# EAGLE design mcp801_test (EAGLE 6.5.0)

## Sheet 1 of 2
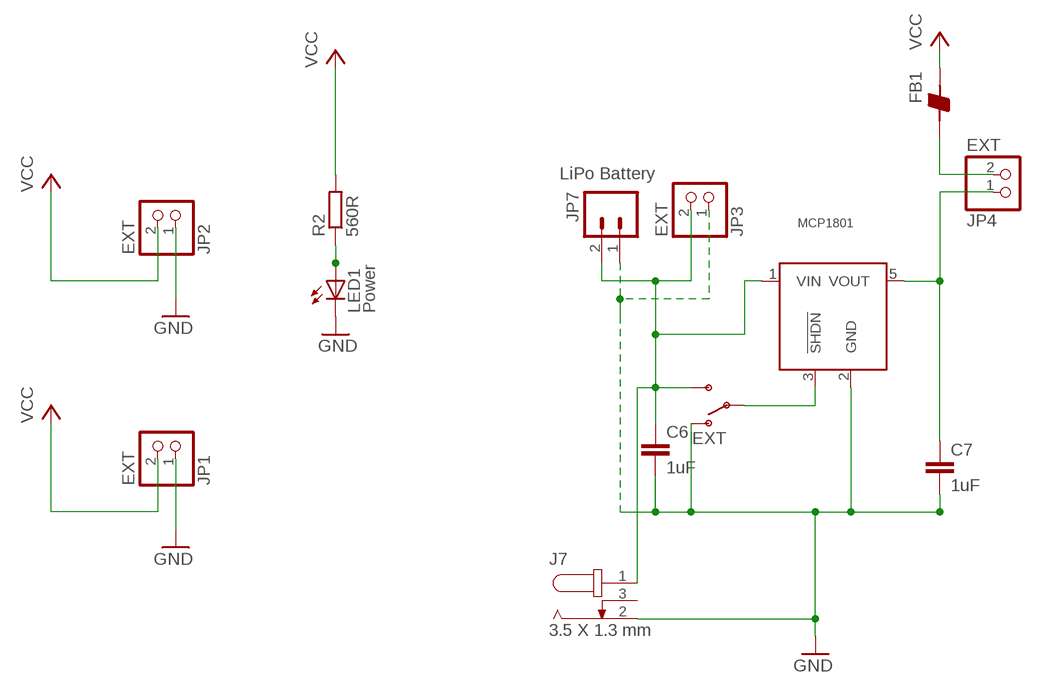
[diagram p0: schematic, sheet 1]

### Parts
C6  1uF  C-EUC0805  [C0805]
C7  1uF  C-EUC0805  [C0805]
FB1  BEAD-0805  [0805]
J7  3.5 X 1.3 mm  DC_JACK_3.5X1.3MM  [3.5X1.3MM_DC_JACK]
JP1  EXT  PINHD-1X2  [1X02]
JP2  EXT  PINHD-1X2  [1X02]
JP3  EXT  PINHD-1X2  [1X02]
JP4  EXT  PINHD-1X2  [1X02]
JP7  LiPo Battery  M02JST-PTH-2  [JST-2-PTH]
LED1  Power  LEDCHIPLED_1206  [CHIPLED_1206]
MCP1801  MCP180XSOT-23-5  [SOT-23-5]
ON  EXT  SWITCH-SPSTPTH  [SWITCH-SPDT]
R2  560R  R-EU_R0805  [R0805]

### Nets
GND [GND]: C6.2 C7.2 J7.2 JP1.1 JP2.1 JP3.1 JP7.1 LED1.C MCP1801.2(GND) ON.1(O)
N$1: MCP1801.3(!SHDN) ON.2(P)
N$2 [VCCEXT]: FB1.1 JP4.2
N$4: LED1.A R2.1
VCC [VCC]: FB1.2 JP1.2 JP2.2 R2.2
VCCEXT [VCCEXT]: C6.1 J7.1 JP3.2 JP7.2 MCP1801.1(VIN) ON.3(S)
VCCREGOUT [VCCEXT]: C7.1 JP4.1 MCP1801.5(VOUT)
Unconnected: J7.3

## Sheet 2 of 2

## Library data of the parts
C6 C7 = resistor:C-EU: CAPACITOR, European symbol
FB1 = CH_passive:BEAD
J7 = MY_CONN:DC_JACK_3.5X1.3MM
JP1-JP4 = pinhead:PINHD-1X2: PIN HEADER
JP7 = SparkFun:M02: Header 2 Standard 2-pin 0.1" header. Use with straight break away headers (SKU : PRT-00116), right angle break away headers (PRT-00553), swiss pins (PRT-00743), machine pins (PRT-00117), and female headers (PRT-00115). Molex polarized connector foot print use with SKU : PRT-08233 with associated crimp pins and housings.
LED1 = adafruit:LED: LED OSRAM: - CHIPLED LG R971, LG N971, LY N971, LG Q971, LY Q971, LO R971, LY R971 LH N974, LH R974 LS Q976, LO Q976, LY Q976 LO Q996 - Hyper CHIPLED LW Q18S LB Q993, LB Q99A, LB R99A - SideLED LS A670, LO A670, LY A670, LG A670, LP A670 LB A673, LV A673, LT A673, LW A673 LH A674 LY A675 LS A676, LA A676, LO A676, LY A676, LW A676 LS A679, LY A679, LG A679 - Hyper Micro SIDELED® LS Y876, LA Y876, LO Y876, LY Y876 LT Y87S - SmartLED LW L88C, LW L88S LB L89C, LB L89S, LG L890 LS L89K, LO L89K, LY L89K LS L896, LA L896, LO L896, LY L896 - TOPLED LS T670, LO T670, LY T670, LG T670, LP T670 LSG T670, LSP T670, LSY T670, LOP T670, LYG T670 LG T671, LOG T671, LSG T671 LB T673, LV T673, LT T673, LW T673 LH T674 LS T676, LA T676, LO T676, LY T676, LB T676, LH T676, LSB T676, LW T676 LB T67C, LV T67C, LT T67C, LS T67K, LO T67K, LY T67K, LW E67C LS E67B, LA E67B, LO E67B, LY E67B, LB E67C, LV E67C, LT E67C LW T67C LS T679, LY T679, LG T679 LS T770, LO T770, LY T770, LG T770, LP T770 LB T773, LV T773, LT T773, LW T773 LH T774 LS E675, LA E675, LY E675, LS T675 LS T776, LA T776, LO T776, LY T776, LB T776 LHGB T686 LT T68C, LB T68C - Hyper Mini TOPLED® LB M676 - Mini TOPLED Santana® LG M470 LS M47K, LO M47K, LY M47K Source: http://www.osram.convergy.de/
MCP1801 = MiscOxde:MCP180X: Cheap Microchip LDO
ON = SparkFun:SWITCH-SPST: SPST Switch Simple slide switch. Spark Fun Electronics SKU : COM-00102
R2 = resistor:R-EU_: RESISTOR, European symbol

## Net classes
0 default: width 0.279 mm, drill 0.508 mm, clearance 0.229 mm
1 GND: width 0.61 mm, drill 0.508 mm, clearance 0.229 mm
2 VCC: width 0.61 mm, drill 0.508 mm, clearance 0.229 mm
3 AD: width 0.33 mm, drill 0.508 mm, clearance 0.229 mm
4 VCCEXT: width 0.762 mm, drill 0.508 mm, clearance 0.229 mm

## Board
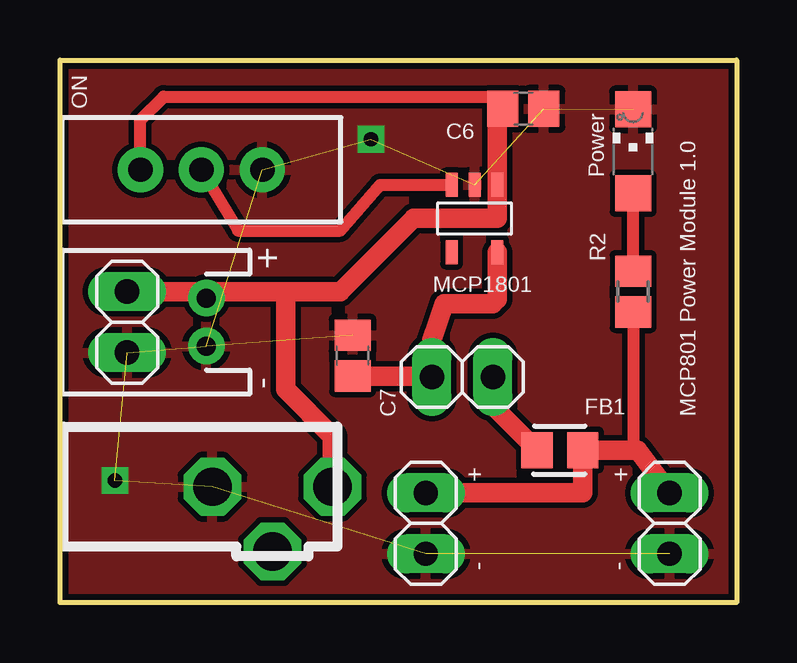
[diagram p1: board, top side]
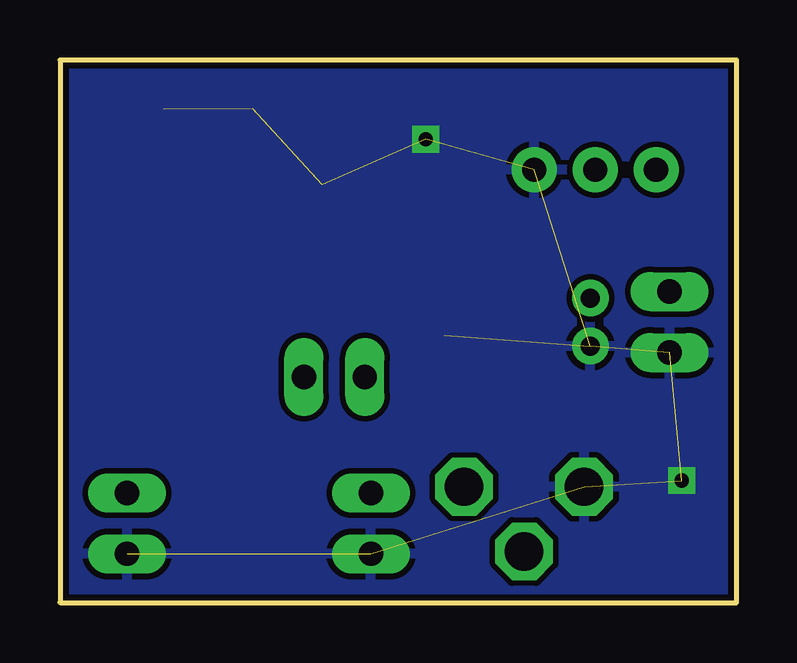
[diagram p2: board, bottom side, seen from below]

Size 28.19 x 22.61 mm. Coordinates in mm from the lower left corner, seen from the top.
Outline: 0,22.61 28.19,22.61 28.19,0 0,0 0,22.61
Copper layers (1*16): Top 0.035mm / dielectric 1.5mm / Bottom 0.035mm
Design rules "SparkFun *": minimum track width 10mil, minimum drill 20mil, track to track 8mil, track to pad 8mil, pad to pad 8mil, via to via 8mil, smd to smd 8mil, copper to edge 10mil, drill to drill 8mil, minimum pad ring 12mil, minimum via ring 10mil, stop-mask expansion 4mil, vias tented up to drill 25mil, thermal gap 10mil

### Footprints (pad centres in the part's own frame; a part is rotated, then mirrored left to right if it is on the bottom)
C0805 = smd 1.3 x 1.5: 1 -0.85,0; 2 0.85,0
0805 = smd 1.3 x 1.5: 1 -0.95,0; 2 0.95,0
3.5X1.3MM_DC_JACK = drill 1.6 octagon: 1 0,0; 2 -5,0; 3 -2.5,-2.7
1X02 = drill 1.016 long: 1 -1.27,0; 2 1.27,0
JST-2-PTH = drill 0.787 pad 1.524: 1 -1,0; 2 1,0
CHIPLED_1206 = smd 1.5 x 1.5: A 0,-1.75; C 0,1.75
SOT-23-5 = smd 0.5 x 1: 1 -0.95,-1.397; 2 0,-1.397; 3 0.95,-1.397; 4 0.95,1.397; 5 -0.95,1.397
SWITCH-SPDT = drill 1.016 pad 1.88: 1 0,2.54; 2 0,0; 3 0,-2.54
R0805 = smd 1.3 x 1.5: 1 -0.85,0; 2 0.85,0

### Placement (x,y rotation side)
C6  19.3,20.57 0 top
C7  12.19,10.29 90 top
FB1  20.83,6.35 0 top
J7  11.35,4.83 0 top
JP1  25.4,3.3 90 top
JP2  15.24,3.3 90 top
JP3  2.79,11.68 90 top
JP4  16.76,9.4 0 top
JP7  6.1,11.68 90 top
LED1  23.88,18.8 0 top
MCP1801  17.27,16 180 top
ON  5.89,18.03 270 top
R2  23.88,12.95 270 top

### Tracks (layer width: path | path; a pad name or v marks a point on that pad's centre or on a via)
GND  (via drill 0.6)  (11 unrouted)
  other vias: 2.29,5.08 12.95,19.3
  pour Top: -1.14,23.62 28.83,23.62 28.83,-0.51 -1.14,-0.51
  pour Bottom: -1.14,23.62 28.83,23.62 28.83,-0.51 -1.14,-0.51
N$1
  Top 0.508: ON.2 7.42,15.49 11.68,15.49 13.34,17.4 MCP1801.3
N$2
  Top 0.813: FB1.1 18.03,8.19 JP4.2
N$4
  Top 0.508: R2.1 LED1.A
VCC
  Top 0.508: R2.2 23.88,6.35
  Top 0.813: JP1.2 24.06,6.35 23.88,6.35 FB1.2 21.78,4.57 JP2.2
VCCEXT
  Top 0.508: ON.3 3.35,20.12 4.32,21.08 17.95,21.08 C6.1
  Top 0.813: JP3.2 5.84,12.95 JP7.2 6.37,12.95 9.4,12.95 | J7.1 11.35,6.93 9.4,8.89 9.4,12.95 | C6.1 18.22,20.34 MCP1801.1 18.22,16 14.73,16 11.68,12.95 9.4,12.95
VCCREGOUT
  Top 0.813: C7.1 15.46,9.44 JP4.1 15.49,10.92 16,12.45 18.03,12.45 18.22,12.63 MCP1801.5

### Text on the board
tNames: + | - | MCP801 Power Module 1.0 | + | + | - | -